# Altium schematic sheet Attenuator.SchDoc
size A
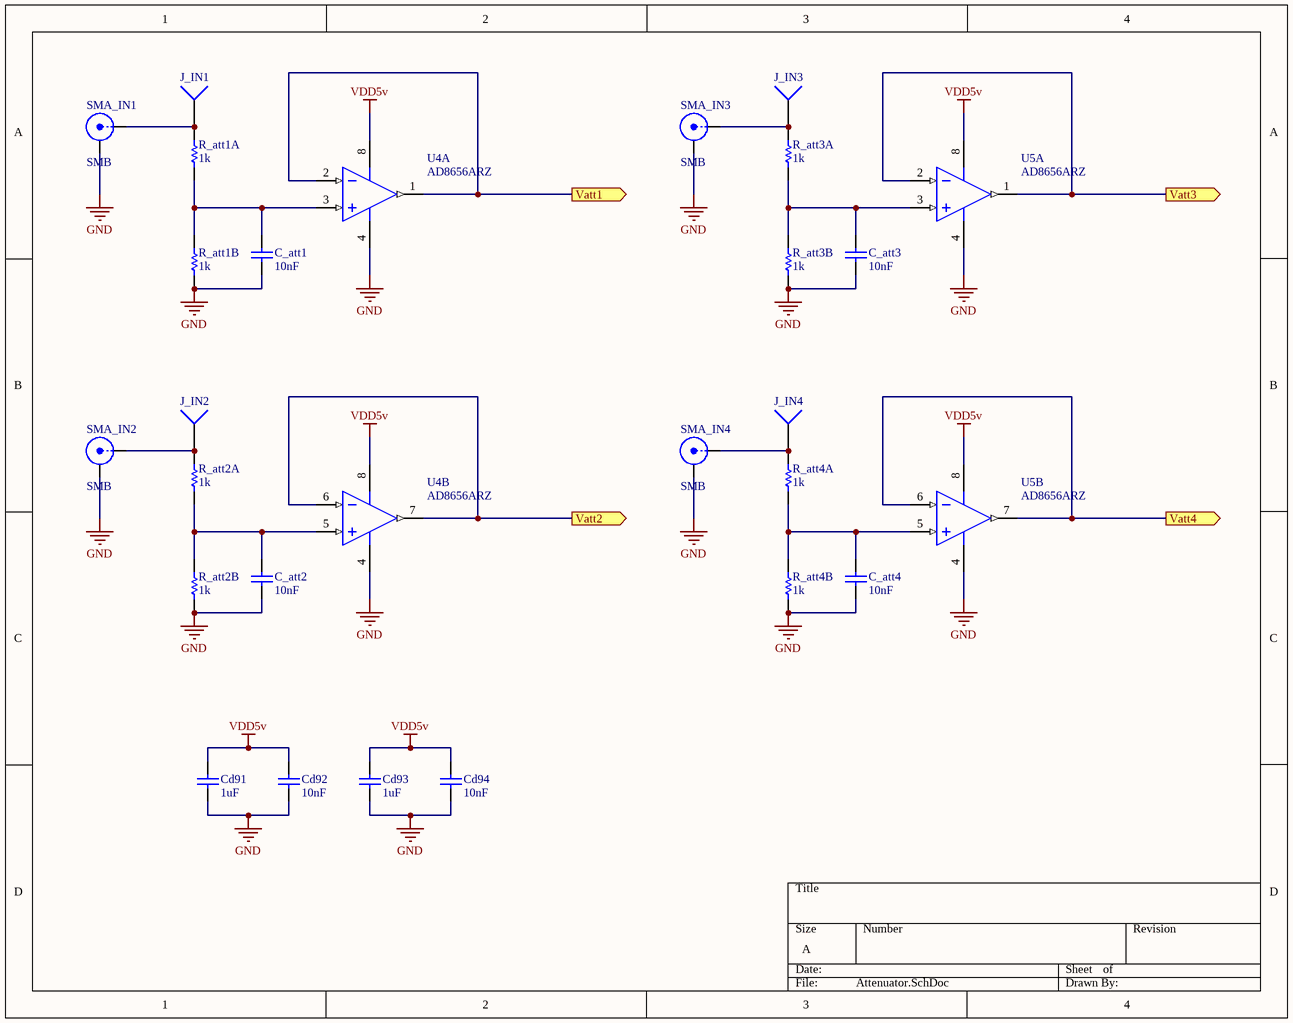
[diagram p0: Attenuator.SchDoc]

## Parts
C_att1  value 10nF  [1608[0603]]  (hidden comment: Cap)
C_att2  value 10nF  [1608[0603]]  (hidden comment: Cap)
C_att3  value 10nF  [1608[0603]]  (hidden comment: Cap)
C_att4  value 10nF  [1608[0603]]  (hidden comment: Cap)
Cd91  value 1uF  [1608[0603]]  (hidden comment: Cap)
Cd92  value 10nF  [1608[0603]]  (hidden comment: Cap)
Cd93  value 1uF  [1608[0603]]  (hidden comment: Cap)
Cd94  value 10nF  [1608[0603]]  (hidden comment: Cap)
J_IN1  Socket  [PIN1]  (value not drawn)
J_IN2  Socket  [PIN1]  (value not drawn)
J_IN3  Socket  [PIN1]  (value not drawn)
J_IN4  Socket  [PIN1]  (value not drawn)
R_att1A  value 1k  [1608[0603]]  (hidden comment: Res1)
R_att1B  value 1k  [1608[0603]]  (hidden comment: Res1)
R_att2A  value 1k  [1608[0603]]  (hidden comment: Res1)
R_att2B  value 1k  [1608[0603]]  (hidden comment: Res1)
R_att3A  value 1k  [1608[0603]]  (hidden comment: Res1)
R_att3B  value 1k  [1608[0603]]  (hidden comment: Res1)
R_att4A  value 1k  [1608[0603]]  (hidden comment: Res1)
R_att4B  value 1k  [1608[0603]]  (hidden comment: Res1)
SMA_IN1  SMB  [SMB_V-RJ45]
SMA_IN2  SMB  [SMB_V-RJ45]
SMA_IN3  SMB  [SMB_V-RJ45]
SMA_IN4  SMB  [SMB_V-RJ45]
U4  AD8656ARZ  [ADI-R-8_N]  (parts A,B of 2)
U5  AD8656ARZ  [ADI-R-8_N]  (parts A,B of 2)

## Ports
Vatt1 (out), Vatt2 (out), Vatt3 (out), Vatt4 (out)

## Nets
GND: C_att1.2 C_att2.2 C_att3.2 C_att4.2 Cd91.2 Cd92.2 Cd93.2 Cd94.2 R_att1B.1 R_att2B.1 R_att3B.1 R_att4B.1 SMA_IN1.2(Y) SMA_IN2.2(Y) SMA_IN3.2(Y) SMA_IN4.2(Y) U4.4(-V) U5.4(-V)
VDD5v: Cd91.1 Cd92.1 Cd93.1 Cd94.1 U4.8(+V) U5.8(+V)
Vatt1: U4.1(OUT_A) U4.2(-IN_A) ; port Vatt1
Vatt2: U4.6(-IN_B) U4.7(OUT_B) ; port Vatt2
Vatt3: U5.1(OUT_A) U5.2(-IN_A) ; port Vatt3
Vatt4: U5.6(-IN_B) U5.7(OUT_B) ; port Vatt4
NetC_att1_1: C_att1.1 R_att1A.1 R_att1B.2 U4.3(+IN_A)
NetC_att2_1: C_att2.1 R_att2A.1 R_att2B.2 U4.5(+IN_B)
NetC_att3_1: C_att3.1 R_att3A.1 R_att3B.2 U5.3(+IN_A)
NetC_att4_1: C_att4.1 R_att4A.1 R_att4B.2 U5.5(+IN_B)
NetJ_IN1_1: J_IN1.1 R_att1A.2 SMA_IN1.1(X)
NetJ_IN2_1: J_IN2.1 R_att2A.2 SMA_IN2.1(X)
NetJ_IN3_1: J_IN3.1 R_att3A.2 SMA_IN3.1(X)
NetJ_IN4_1: J_IN4.1 R_att4A.2 SMA_IN4.1(X)

## Library data of the parts
C_att1-C_att4 Cd91-Cd94 = Cap: Capacitor; Published: 8-Jun-2000; LatestRevisionDate: 17-Jul-2002; LatestRevisionNote: Re-released for DXP Platform.; PackageReference: RAD-0.3; Publisher: Altium Limited; PackageDescription: Radial Cap, Thru-Hole; 2 Leads; 0.3 in Pin Spacing; Digi-Key: 445-7534-1-ND
R_att1A R_att1B R_att2A R_att2B R_att3A R_att3B R_att4A R_att4B = Res1: Resistor; Published: 8-Jun-2000; LatestRevisionDate: 17-Jul-2002; LatestRevisionNote: Re-released for DXP Platform.; PackageReference: AXIAL-0.3; Publisher: Altium Limited; PackageDescription: Axial Device, Thru-Hole; 2 Leads; 0.3 in Pin Spacing; Digikey PN: P1.00KCCT-ND
SMA_IN1-SMA_IN4 = SMB: SMB Straight Connector; LatestRevisionDate: 17-Jul-2002; LatestRevisionNote: Re-released for DXP Platform.; Publisher: Altium Limited
U4 U5 = AD8656ARZ: Double Channel RRIO Operational Amplifier, 28 MHz BW, 11 V/us SR, Industrial, 8-pin SOIC (R-8), Tube; Generic Part Number: AD8656; Manufacturer: Analog Devices; Amplifiers Per Package: 2; Automotive Qualified: Yes; Input Bias Current: 1pA; Input Offset Voltage: 50uV; Iq/Amp: 4.5mA; Slew Rate: 11V/us; Small Signal Bandwidth: 28MHz; V Span Max: 5.5V; V Span Min: 2.7V; DatasheetVersion: Rev. B; PackageVersion: 060506-A; PackageReference: R-8; PackageDescription: 8-Pin Standard Small Outline Package, Body 3.9 x 4.9 mm, Pitch 1.27 mm; Supplier 1: Digi-Key; Supplier Part Number 1: AD8656ARZ-ND; Supplier 2: Farnell; Supplier Part Number 2: 1117887; Supplier 3: Newark; Supplier Part Number 3: 19M0993; Mounting Technology: Surface Mount; Code_JEDEC: MS-012-AA; PartNumber: AD8656ARZ; ComponentLink1Description: Manufacturer URL; ComponentLink1URL: http://www.analog.com/en/index.html; ComponentLink2Description: Datasheet; ComponentLink2URL: http://www.analog.com/static/imported-files/data_sheets/AD8655_8656.pdf; ComponentLink3Description: Package Specification; ComponentLink3URL: http://www.analog.com/static/imported-files/packages/PKG_PDF/SOIC_Narrow%20(R)/R_8.pdf
J_IN1-J_IN4 = Socket: LatestRevisionDate: 17-Jul-2002; LatestRevisionNote: Re-released for DXP Platform.; Publisher: Altium Limited